# EAGLE schematic wroom32 (EAGLE 9.6.2)
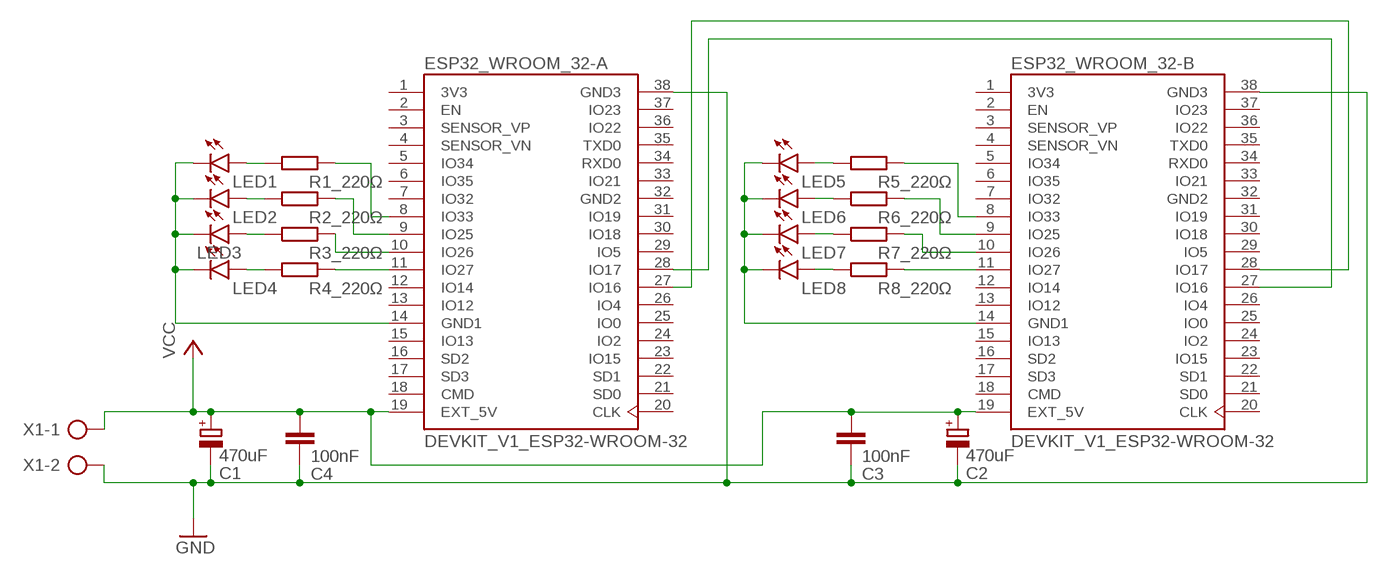
[diagram p0: schematic, sheet 1]

## Parts
C1  470uF  CPOL-EUE2.5-7  [E2,5-7]
C2  470uF  CPOL-EUE2.5-7  [E2,5-7]
C3  100nF  C-EU025-024X044  [C025-024X044]
C4  100nF  C-EU025-024X044  [C025-024X044]
ESP32_WROOM_32-A  DEVKIT_V1_ESP32-WROOM-32  [MODULE_DEVKIT_V1_ESP32-WROOM-32]
ESP32_WROOM_32-B  DEVKIT_V1_ESP32-WROOM-32  [MODULE_DEVKIT_V1_ESP32-WROOM-32]
LED1  TLLG4400  [LED3MM]
LED2  TLLG4400  [LED3MM]
LED3  TLLG4400  [LED3MM]
LED4  TLLG4400  [LED3MM]
LED5  TLLG4400  [LED3MM]
LED6  TLLG4400  [LED3MM]
LED7  TLLG4400  [LED3MM]
LED8  TLLG4400  [LED3MM]
R1_220Ω  R-EU_0207/10  [0207/10]
R2_220Ω  R-EU_0207/10  [0207/10]
R3_220Ω  R-EU_0207/10  [0207/10]
R4_220Ω  R-EU_0207/10  [0207/10]
R5_220Ω  R-EU_0207/10  [0207/10]
R6_220Ω  R-EU_0207/10  [0207/10]
R7_220Ω  R-EU_0207/10  [0207/10]
R8_220Ω  R-EU_0207/10  [0207/10]
X1  AK500/2-H  [AK500/2-H]

## Nets
GND: C1.- C2.- C3.2 C4.2 ESP32_WROOM_32-A.38(GND3) ESP32_WROOM_32-B.38(GND3) X1.2
N$1: ESP32_WROOM_32-A.28(IO17) ESP32_WROOM_32-B.27(IO16)
N$2: ESP32_WROOM_32-A.27(IO16) ESP32_WROOM_32-B.28(IO17)
N$3: ESP32_WROOM_32-B.14(GND1) LED5.K(C) LED6.K(C) LED7.K(C) LED8.K(C)
N$4: ESP32_WROOM_32-A.14(GND1) LED1.K(C) LED2.K(C) LED3.K(C) LED4.K(C)
N$5: LED1.A R1_220Ω.1
N$6: LED2.A R2_220Ω.1
N$7: LED3.A R3_220Ω.1
N$8: LED4.A R4_220Ω.1
N$9: ESP32_WROOM_32-A.11(IO27) R4_220Ω.2
N$10: ESP32_WROOM_32-A.10(IO26) R3_220Ω.2
N$11: ESP32_WROOM_32-A.9(IO25) R2_220Ω.2
N$12: ESP32_WROOM_32-A.8(IO33) R1_220Ω.2
N$13: ESP32_WROOM_32-B.8(IO33) R5_220Ω.2
N$14: ESP32_WROOM_32-B.9(IO25) R6_220Ω.2
N$15: ESP32_WROOM_32-B.10(IO26) R7_220Ω.2
N$16: ESP32_WROOM_32-B.11(IO27) R8_220Ω.2
N$17: LED8.A R8_220Ω.1
N$18: LED7.A R7_220Ω.1
N$19: LED6.A R6_220Ω.1
N$20: LED5.A R5_220Ω.1
VCC: C1.+ C2.+ C3.1 C4.1 ESP32_WROOM_32-A.19(EXT_5V) ESP32_WROOM_32-B.19(EXT_5V) X1.1
Unconnected: ESP32_WROOM_32-A.2(EN) ESP32_WROOM_32-A.3(SENSOR_VP) ESP32_WROOM_32-A.4(SENSOR_VN) ESP32_WROOM_32-A.5(IO34) ESP32_WROOM_32-A.6(IO35) ESP32_WROOM_32-A.7(IO32) ESP32_WROOM_32-A.12(IO14) ESP32_WROOM_32-A.13(IO12) ESP32_WROOM_32-A.15(IO13) ESP32_WROOM_32-A.16(SD2) ESP32_WROOM_32-A.17(SD3) ESP32_WROOM_32-A.18(CMD) ESP32_WROOM_32-A.20(CLK) ESP32_WROOM_32-A.21(SD0) ESP32_WROOM_32-A.22(SD1) ESP32_WROOM_32-A.23(IO15) ESP32_WROOM_32-A.24(IO2) ESP32_WROOM_32-A.25(IO0) ESP32_WROOM_32-A.26(IO4) ESP32_WROOM_32-A.29(IO5) ESP32_WROOM_32-A.30(IO18) ESP32_WROOM_32-A.31(IO19) ESP32_WROOM_32-A.33(IO21) ESP32_WROOM_32-A.34(RXD0) ESP32_WROOM_32-A.35(TXD0) ESP32_WROOM_32-A.36(IO22) ESP32_WROOM_32-A.37(IO23) ESP32_WROOM_32-B.2(EN) ESP32_WROOM_32-B.3(SENSOR_VP) ESP32_WROOM_32-B.4(SENSOR_VN) ESP32_WROOM_32-B.5(IO34) ESP32_WROOM_32-B.6(IO35) ESP32_WROOM_32-B.7(IO32) ESP32_WROOM_32-B.12(IO14) ESP32_WROOM_32-B.13(IO12) ESP32_WROOM_32-B.15(IO13) ESP32_WROOM_32-B.16(SD2) ESP32_WROOM_32-B.17(SD3) ESP32_WROOM_32-B.18(CMD) ESP32_WROOM_32-B.20(CLK) ESP32_WROOM_32-B.21(SD0) ESP32_WROOM_32-B.22(SD1) ESP32_WROOM_32-B.23(IO15) ESP32_WROOM_32-B.24(IO2) ESP32_WROOM_32-B.25(IO0) ESP32_WROOM_32-B.26(IO4) ESP32_WROOM_32-B.29(IO5) ESP32_WROOM_32-B.30(IO18) ESP32_WROOM_32-B.31(IO19) ESP32_WROOM_32-B.33(IO21) ESP32_WROOM_32-B.34(RXD0) ESP32_WROOM_32-B.35(TXD0) ESP32_WROOM_32-B.36(IO22) ESP32_WROOM_32-B.37(IO23)

## Power pins joined to a net without a drawn wire
3V3: ESP32_WROOM_32-A.1(3V3) ESP32_WROOM_32-B.1(3V3)
GND2: ESP32_WROOM_32-A.32(GND2) ESP32_WROOM_32-B.32(GND2)

## Library data of the parts
C1 C2 = rcl:CPOL-EU: POLARIZED CAPACITOR, European symbol; SPICEPREFIX: C
C3 C4 = rcl:C-EU: CAPACITOR, European symbol; SPICEPREFIX: C
ESP32_WROOM_32-A ESP32_WROOM_32-B = DEVKIT_V1_ESP32-WROOM-32 (1):DEVKIT_V1_ESP32-WROOM-32: Check availability <https://pricing.snapeda.com/parts/DEVKIT%20V1%20ESP32-WROOM-32/Espressif%20Systems/view-part?ref=eda>; AVAILABILITY: Not in stock; CHECK_PRICES: https://www.snapeda.com/parts/DEVKIT%20V1%20ESP32-WROOM-32/Espressif+Systems/view-part/?ref=eda; DESCRIPTION: WROOM-32 Development Board ESP32 ESP-32S WiFi Bluetooth Dev Module; MF: Espressif Systems; MP: DEVKIT V1 ESP32-WROOM-32; PACKAGE: Package; PRICE: None; SNAPEDA_LINK: https://www.snapeda.com/parts/DEVKIT%20V1%20ESP32-WROOM-32/Espressif+Systems/view-part/?ref=snap
LED1-LED8 = led:TLLG4400: Low Current (2mA) LED 3 mm Tinted Diffused Package color GREEN Source: Data sheet <http://www.farnell.com/datasheets/391098.pdf>; MF: VISHAY SEMICONDUCTOR; OC_FARNELL: 1612435
R1_220Ω R2_220Ω R3_220Ω R4_220Ω R5_220Ω R6_220Ω R7_220Ω R8_220Ω = rcl:R-EU_: RESISTOR, European symbol; SPICEPREFIX: R
X1 = con-ptr500:AK500/2-H: CONNECTOR Aug. 2004 / PTR Meßtechnik: Die Bezeichnung der Serie AK505 wurde geändert. Es handelt sich hierbei um AK500 in horizontaler Ausführung.; OC_FARNELL: unknown; OC_NEWARK: unknown